# EAGLE schematic LED MATRIX PTH (EAGLE 8.3.2)
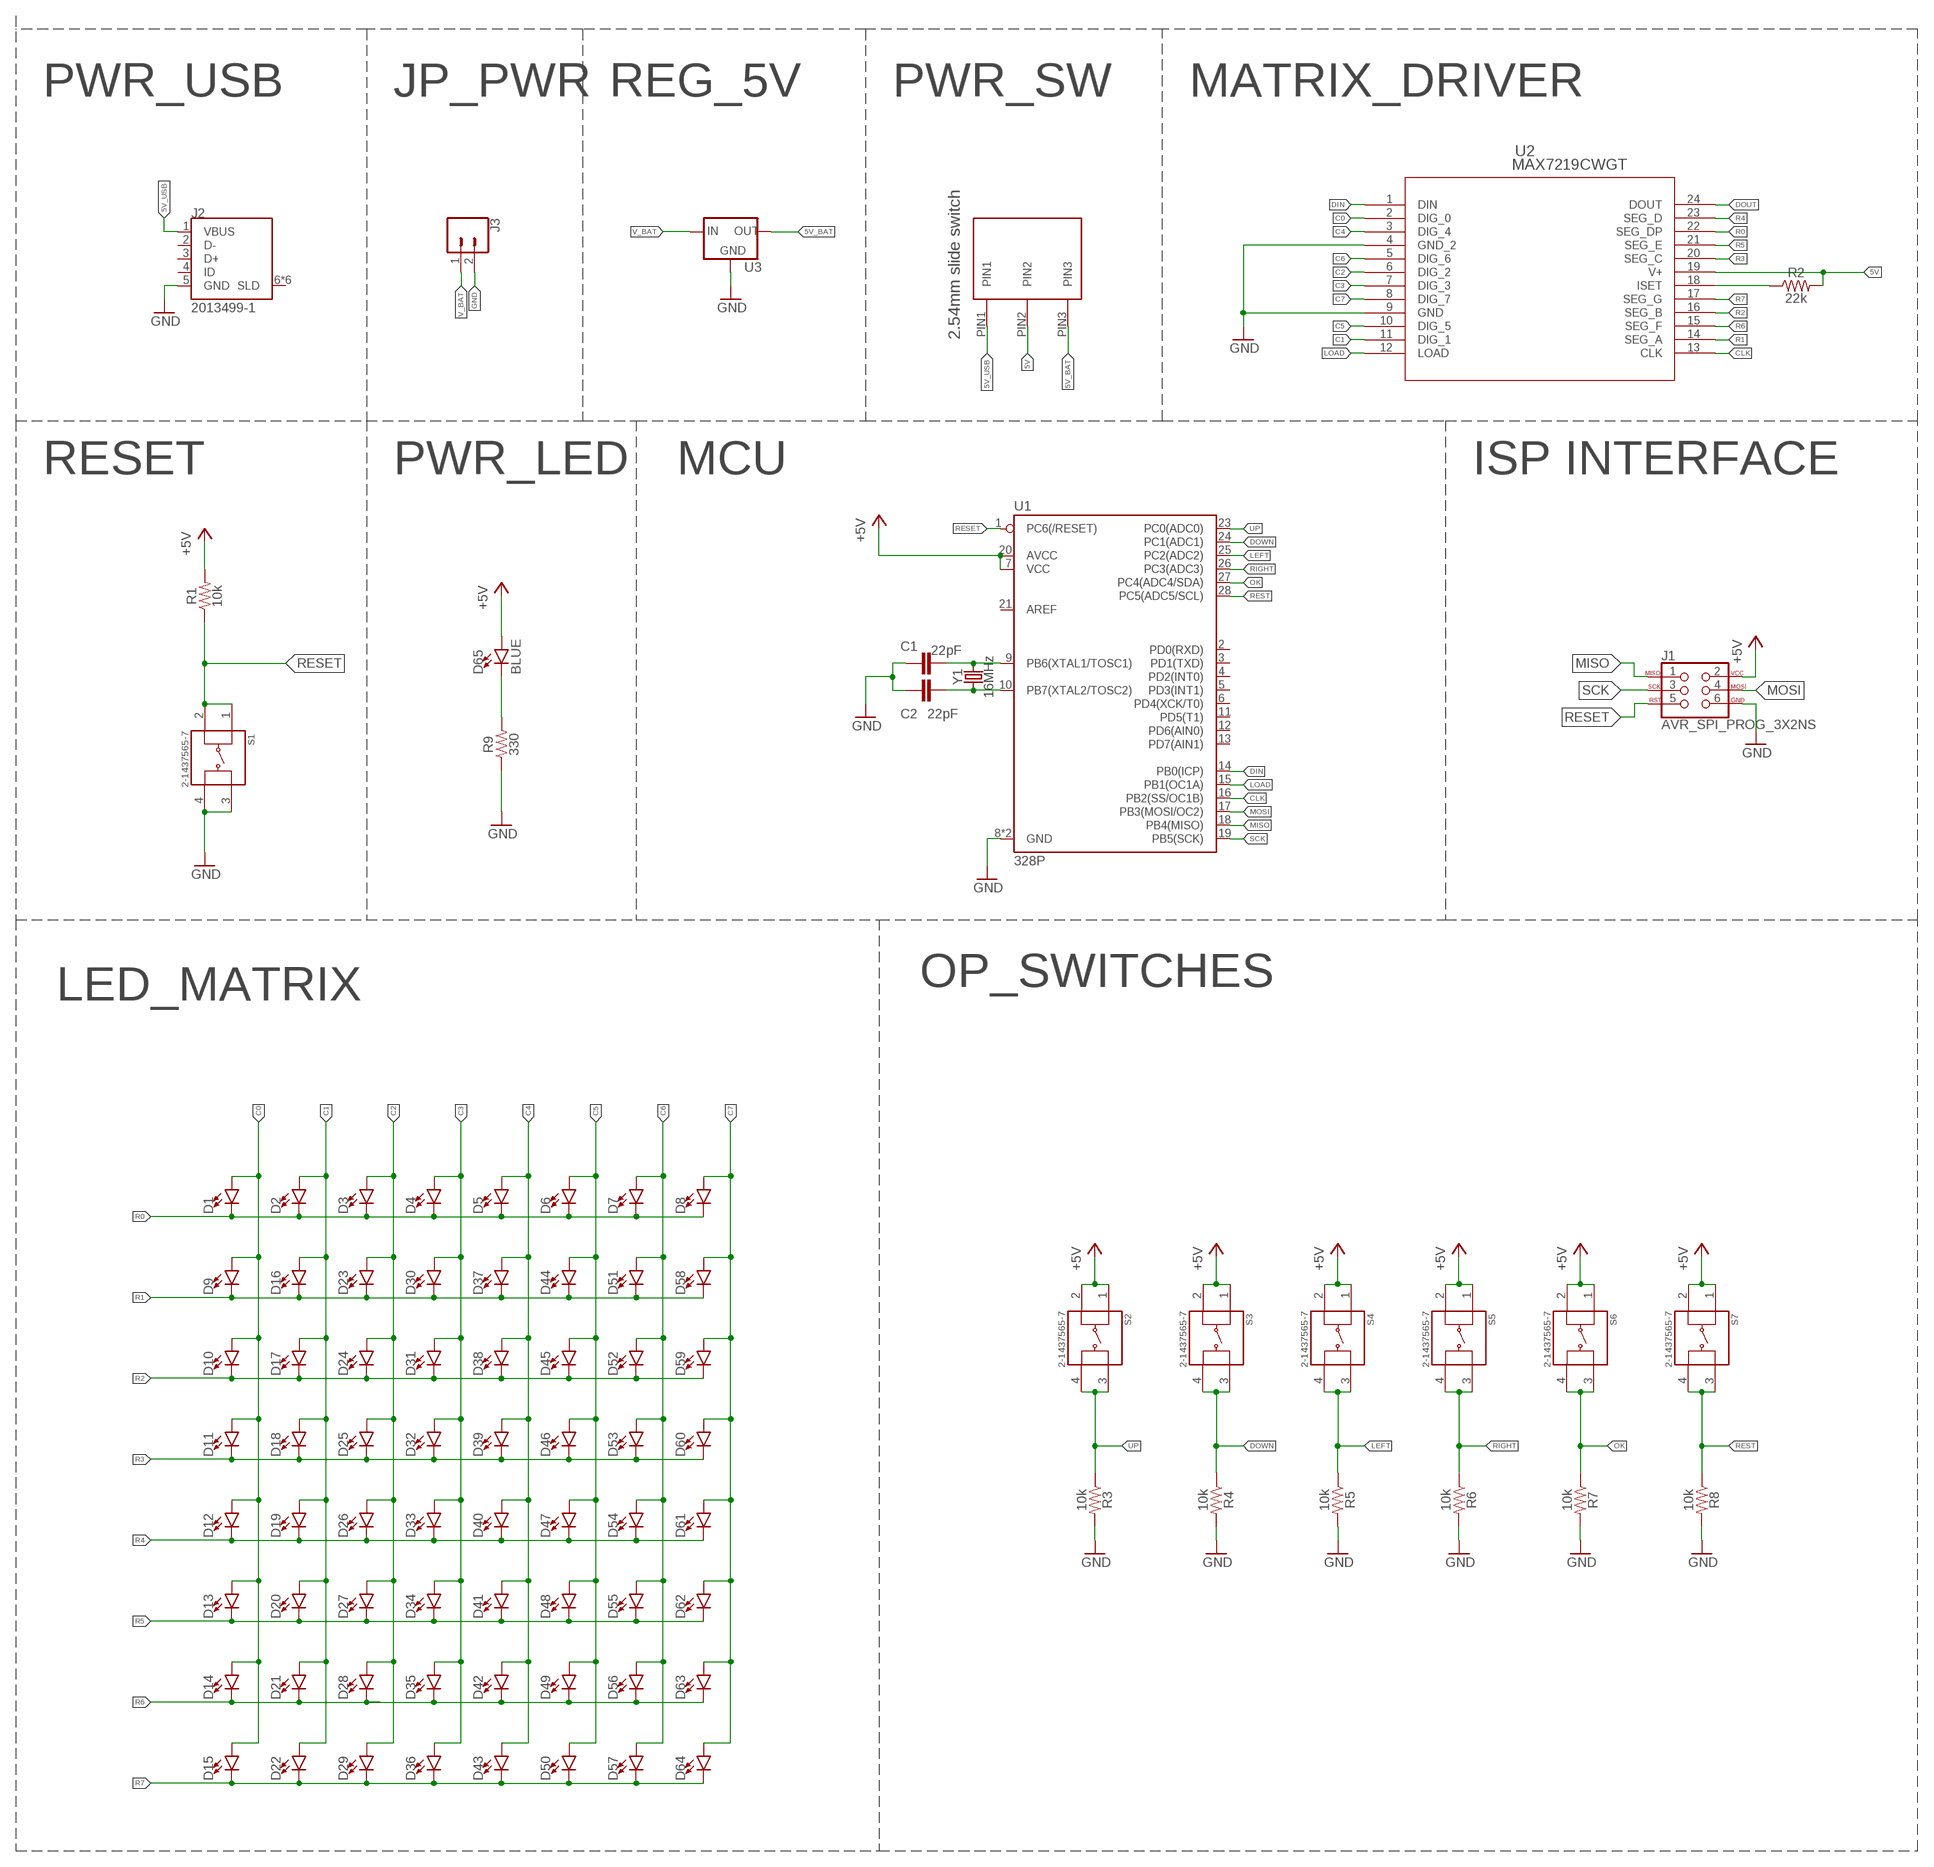
[diagram p0: schematic, sheet 1]

## Parts
C1  22pF  22PF-0603-50V-5%  [0603]
C2  22pF  22PF-0603-50V-5%  [0603]
D1  LED5MM  [LED_5MM]
D2  LED5MM  [LED_5MM]
D3  LED5MM  [LED_5MM]
D4  LED5MM  [LED_5MM]
D5  LED5MM  [LED_5MM]
D6  LED5MM  [LED_5MM]
D7  LED5MM  [LED_5MM]
D8  LED5MM  [LED_5MM]
D9  LED5MM  [LED_5MM]
D10  LED5MM  [LED_5MM]
D11  LED5MM  [LED_5MM]
D12  LED5MM  [LED_5MM]
D13  LED5MM  [LED_5MM]
D14  LED5MM  [LED_5MM]
D15  LED5MM  [LED_5MM]
D16  LED5MM  [LED_5MM]
D17  LED5MM  [LED_5MM]
D18  LED5MM  [LED_5MM]
D19  LED5MM  [LED_5MM]
D20  LED5MM  [LED_5MM]
D21  LED5MM  [LED_5MM]
D22  LED5MM  [LED_5MM]
D23  LED5MM  [LED_5MM]
D24  LED5MM  [LED_5MM]
D25  LED5MM  [LED_5MM]
D26  LED5MM  [LED_5MM]
D27  LED5MM  [LED_5MM]
D28  LED5MM  [LED_5MM]
D29  LED5MM  [LED_5MM]
D30  LED5MM  [LED_5MM]
D31  LED5MM  [LED_5MM]
D32  LED5MM  [LED_5MM]
D33  LED5MM  [LED_5MM]
D34  LED5MM  [LED_5MM]
D35  LED5MM  [LED_5MM]
D36  LED5MM  [LED_5MM]
D37  LED5MM  [LED_5MM]
D38  LED5MM  [LED_5MM]
D39  LED5MM  [LED_5MM]
D40  LED5MM  [LED_5MM]
D41  LED5MM  [LED_5MM]
D42  LED5MM  [LED_5MM]
D43  LED5MM  [LED_5MM]
D44  LED5MM  [LED_5MM]
D45  LED5MM  [LED_5MM]
D46  LED5MM  [LED_5MM]
D47  LED5MM  [LED_5MM]
D48  LED5MM  [LED_5MM]
D49  LED5MM  [LED_5MM]
D50  LED5MM  [LED_5MM]
D51  LED5MM  [LED_5MM]
D52  LED5MM  [LED_5MM]
D53  LED5MM  [LED_5MM]
D54  LED5MM  [LED_5MM]
D55  LED5MM  [LED_5MM]
D56  LED5MM  [LED_5MM]
D57  LED5MM  [LED_5MM]
D58  LED5MM  [LED_5MM]
D59  LED5MM  [LED_5MM]
D60  LED5MM  [LED_5MM]
D61  LED5MM  [LED_5MM]
D62  LED5MM  [LED_5MM]
D63  LED5MM  [LED_5MM]
D64  LED5MM  [LED_5MM]
D65  BLUE  LED-BLUE0603  [LED-0603]
J1  AVR_SPI_PROG_3X2NS  [2X3-NS]
J2  2013499-1  [TE_2013499-1]
J3  CONN_02  [1X02]
R1  10k  10KOHM-0603-1/10W-1%  [0603]
R2  22k  22KOHM-0603-1/10W-1%  [0603]
R3  10k  10KOHM-0603-1/10W-1%  [0603]
R4  10k  10KOHM-0603-1/10W-1%  [0603]
R5  10k  10KOHM-0603-1/10W-1%  [0603]
R6  10k  10KOHM-0603-1/10W-1%  [0603]
R7  10k  10KOHM-0603-1/10W-1%  [0603]
R8  10k  10KOHM-0603-1/10W-1%  [0603]
R9  330  330OHM-0603-1/10W-1%  [0603]
S1  2-1437565-7  [SW_2-1437565-7]
S2  2-1437565-7  [SW_2-1437565-7]
S3  2-1437565-7  [SW_2-1437565-7]
S4  2-1437565-7  [SW_2-1437565-7]
S5  2-1437565-7  [SW_2-1437565-7]
S6  2-1437565-7  [SW_2-1437565-7]
S7  2-1437565-7  [SW_2-1437565-7]
U1  328P  ATMEGA328P_PDIP  [DIP28]
U2  MAX7219CWGT  [21-0042B_24]
U3  V_REG_78XXSIDE  [78XXL]
U$1  TS02_SWITCH  [TS02_SWITCH]
Y1  16MHz  CRYSTAL-16MHZPTH-HC49US  [HC49US]

## Nets
5V: R2.2 U2.19(V+) U$1.PIN2
5V_BAT: U3.OUT U$1.PIN3
5V_USB: J2.1(VBUS) U$1.PIN1
+5V: D65.A J1.2 R1.2 S2.1 S2.2 S3.1 S3.2 S4.1 S4.2 S5.1 S5.2 S6.1 S6.2 S7.1 S7.2 U1.7(VCC) U1.20(AVCC)
C0: D1.A D9.A D10.A D11.A D12.A D13.A D14.A D15.A U2.2(DIG_0)
C1: D2.A D16.A D17.A D18.A D19.A D20.A D21.A D22.A U2.11(DIG_1)
C2: D3.A D23.A D24.A D25.A D26.A D27.A D28.A D29.A U2.6(DIG_2)
C3: D4.A D30.A D31.A D32.A D33.A D34.A D35.A D36.A U2.7(DIG_3)
C4: D5.A D37.A D38.A D39.A D40.A D41.A D42.A D43.A U2.3(DIG_4)
C5: D6.A D44.A D45.A D46.A D47.A D48.A D49.A D50.A U2.10(DIG_5)
C6: D7.A D51.A D52.A D53.A D54.A D55.A D56.A D57.A U2.5(DIG_6)
C7: D8.A D58.A D59.A D60.A D61.A D62.A D63.A D64.A U2.8(DIG_7)
CLK: U1.16(PB2(SS/OC1B)) U2.13(CLK)
DIN: U1.14(PB0(ICP)) U2.1(DIN)
DOUT: U2.24(DOUT)
DOWN: R4.1 S3.3 S3.4 U1.24(PC1(ADC1))
GND: C1.1 C2.1 J1.6 J2.5(GND) J3.2 R3.2 R4.2 R5.2 R6.2 R7.2 R8.2 R9.1 S1.3 S1.4 U1.8(GND) U1.22(GND) U2.4(GND_2) U2.9(GND) U3.GND
LEFT: R5.1 S4.3 S4.4 U1.25(PC2(ADC2))
LOAD: U1.15(PB1(OC1A)) U2.12(LOAD)
MISO: J1.1 U1.18(PB4(MISO))
MOSI: J1.4 U1.17(PB3(MOSI/OC2))
N$1: C2.2 U1.10(PB7(XTAL2/TOSC2)) Y1.1
N$2: C1.2 U1.9(PB6(XTAL1/TOSC1)) Y1.2
N$3: R2.1 U2.18(ISET)
N$4: D65.C R9.2
OK: R7.1 S6.3 S6.4 U1.27(PC4(ADC4/SDA))
R0: D1.K(C) D2.K(C) D3.K(C) D4.K(C) D5.K(C) D6.K(C) D7.K(C) D8.K(C) U2.22(SEG_DP)
R1: D9.K(C) D16.K(C) D23.K(C) D30.K(C) D37.K(C) D44.K(C) D51.K(C) D58.K(C) U2.14(SEG_A)
R2: D10.K(C) D17.K(C) D24.K(C) D31.K(C) D38.K(C) D45.K(C) D52.K(C) D59.K(C) U2.16(SEG_B)
R3: D11.K(C) D18.K(C) D25.K(C) D32.K(C) D39.K(C) D46.K(C) D53.K(C) D60.K(C) U2.20(SEG_C)
R4: D12.K(C) D19.K(C) D26.K(C) D33.K(C) D40.K(C) D47.K(C) D54.K(C) D61.K(C) U2.23(SEG_D)
R5: D13.K(C) D20.K(C) D27.K(C) D34.K(C) D41.K(C) D48.K(C) D55.K(C) D62.K(C) U2.21(SEG_E)
R6: D14.K(C) D21.K(C) D28.K(C) D35.K(C) D42.K(C) D49.K(C) D56.K(C) D63.K(C) U2.15(SEG_F)
R7: D15.K(C) D22.K(C) D29.K(C) D36.K(C) D43.K(C) D50.K(C) D57.K(C) D64.K(C) U2.17(SEG_G)
RESET: J1.5 R1.1 S1.1 S1.2 U1.1(PC6(/RESET))
REST: R8.1 S7.3 S7.4 U1.28(PC5(ADC5/SCL))
RIGHT: R6.1 S5.3 S5.4 U1.26(PC3(ADC3))
SCK: J1.3 U1.19(PB5(SCK))
UP: R3.1 S2.3 S2.4 U1.23(PC0(ADC0))
V_BAT: J3.1 U3.IN
Unconnected: J2.2(D-) J2.3(D+) J2.4(ID) J2.6(SLD) J2.7(SLD) J2.8(SLD) J2.9(SLD) J2.10(SLD) J2.11(SLD) U1.2(PD0(RXD)) U1.3(PD1(TXD)) U1.4(PD2(INT0)) U1.5(PD3(INT1)) U1.6(PD4(XCK/T0)) U1.11(PD5(T1)) U1.12(PD6(AIN0)) U1.13(PD7(AIN1)) U1.21(AREF)

## Notes on the sheet
- PWR_USB | JP_PWR | REG_5V | PWR_SW | MATRIX_DRIVER
- RESET | PWR_LED | MCU | ISP INTERFACE
- LED_MATRIX | OP_SWITCHES

## Library data of the parts
C1 C2 = SparkFun-Capacitors:22PF: 22pF ceramic capacitors A capacitor is a passive two-terminal electrical component used to store electrical energy temporarily in an electric field.; PROD_ID: CAP-07876
D1-D64 = SparkFun-LED:LED: LED (Generic) Standard schematic elements and footprints for 5mm, 3mm, 1206, and 0603 sized LEDs. Generic LEDs with no color specified.
D65 = SparkFun-LED:LED-BLUE: Blue SMD LED Used in manufacturing of various products at SparkFun Packages: 0603 - SMD 0603 package [Product Link] <http://www.digikey.com/product-detail/en/SMLE12BC7TT86/511-1589-2-ND/1641808> 1206 - SMD1206 package [Product Link] <http://www.digikey.com/product-detail/en/lite-on-inc/LTST-C150TBKT/160-1643-1-ND/573584> SparkFun Products: ESP8266 Thing-Dev Board <https://www.sparkfun.com/products/13711> RedBoard <https://www.sparkfun.com/products/12757>; PROD_ID: DIO-08575
J1 = SparkFun-Connectors:AVR_SPI_PROG_3X2: AVR ISP 6 Pin This is the reduced ISP connector for AVR programming. Common on Arduino. This footprint will take up less PCB space and can be used with a 10-pin to 6-pin adapter such as SKU: BOB-08508 **Special note about "TEST_POINT" package. The stop mask is on the top side, so if you want your programming test points to be on the bottom of your board, make sure to place this package on the bottom side of the board. This also ensure that the orientation to program from the bottom side will be correct. SparkFun Products: SparkFun ISP Pogo Adapter <https://www.sparkfun.com/products/11591> - NS Tiny AVR Programmer <https://www.sparkfun.com/products/11801> -PTH
J2 = 2013499-1:2013499-1: CONN PCB USB 5POS; AVAILABILITY: Unavailable; CENTERLINE_PITCH: .65 mm[.025 in]; COMMENT: 2013499-1; DESCRIPTION: Micro USB REC type B DIP assy_Au_; MF: TE Connectivity; MP: 2013499-1; NUMBER_OF_POSITIONS: 5; PACKAGE: None; PRICE: None; PRODUCT_TYPE: Connector; TE_PURCHASE_URL: https://www.te.com/usa-en/product-2013499-1.html?te_bu=Cor&te_type=disp&te_campaign=seda_glo_cor-seda-global-disp-prtnr-fy19-seda-model-bom-cta_sma-317_1&elqCampaignId=32493
J3 = SparkFun-Connectors:CONN_02: Multi connection point. Often used as Generic Header-pin footprint for 0.1 inch spaced/style header connections On any of the 0.1 inch spaced packages, you can populate with these: Break Away Headers - Straight <https://www.sparkfun.com/products/116> (PRT-00116) Break Away Male Headers - Right Angle <https://www.sparkfun.com/products/553> (PRT-00553) Female Headers <https://www.sparkfun.com/products/115> (PRT-00115) Break Away Headers - Machine Pin <https://www.sparkfun.com/products/117> (PRT-00117) Break Away Female Headers - Swiss Machine Pin <https://www.sparkfun.com/products/743> (PRT-00743) For SCREWTERMINALS and SPRING TERMINALS visit here: Screw Terimnals on SparkFun.com <https://www.sparkfun.com/search/results?term=Screw+Terminals> (5mm/3.5mm/2.54mm spacing) This device is also useful as a general connection point to wire up your design to another part of your project. Our various solder wires solder well into these plated through hole pads. Hook-Up Wire - Assortment (Stranded, 22 AWG) <https://www.sparkfun.com/products/11375> (PRT-11375) Hook-Up Wire - Assortment (Solid Core, 22 AWG) <https://www.sparkfun.com/products/11367> (PRT-11367) View the entire wire category on our website here <https://www.sparkfun.com/categories/141> Special notes: Molex polarized connector foot print use with: PRT-08233 with associated crimp pins and housings. 2.54_SCREWTERM for use with PRT-10571. 3.5mm Screw Terminal footprints for PRT-08084 5mm Screw Terminal footprints for use with PRT-08432
R1 R3-R8 = SparkFun-Resistors:10KOHM: 10kΩ resistor A resistor is a passive two-terminal electrical component that implements electrical resistance as a circuit element. Resistors act to reduce current flow, and, at the same time, act to lower voltage levels within circuits. - Wikipedia; PROD_ID: RES-00824
R2 = SparkFun-Resistors:22KOHM: 22kΩ resistor A resistor is a passive two-terminal electrical component that implements electrical resistance as a circuit element. Resistors act to reduce current flow, and, at the same time, act to lower voltage levels within circuits. - Wikipedia; PROD_ID: RES-07853
R9 = SparkFun-Resistors:330OHM: 330Ω resistor A resistor is a passive two-terminal electrical component that implements electrical resistance as a circuit element. Resistors act to reduce current flow, and, at the same time, act to lower voltage levels within circuits. - Wikipedia; PROD_ID: RES-00818
S1-S7 = 2-1437565-7:2-1437565-7: FSM2JSMA=SMT,TACTILE,PB SWITCH; MANUFACTURER: TE Connectivity; PARTREV: V; STANDARD: Manufacturer recommendations
U1 = SparkFun-IC-Microcontroller:ATMEGA328P_PDIP: Atmel 328P Through hole ATMEGA328P uC used in the Arduino 32kb flash, 1k EEPROM, 2k SRAM Datasheet <http://www.sparkfun.com/datasheets/Components/SMD/ATMega328.pdf> SparkFun Products Storefront component: AVR 28 Pin 20MHz 32K 6A/D - ATMega328P <https://www.sparkfun.com/products/9061> (COM-09061) SparkFun Simon Says - Through-Hole Soldering Kit <https://www.sparkfun.com/products/10547> (KIT-10547) SparkFun Learn to Solder - Simon Says <https://www.sparkfun.com/products/13708> (KIT-13708) SparkFun BigTime Watch Kit <https://www.sparkfun.com/products/11734> (KIT-11734) SparkFun ClockIt <https://www.sparkfun.com/products/10930> (KIT-10930) SparkFun Serial Enabled LCD Kit <https://www.sparkfun.com/products/10097> (LCD-10097) SparkFun Simon Tilts - Through Hole Soldering Kit <https://www.sparkfun.com/products/12634> (KIT-12634) SparkFun Frequency Counter Kit <https://www.sparkfun.com/products/10140> (KIT-10140) FabFM Radio Kit <https://www.sparkfun.com/products/11043> (KIT-11043) SparkFun Binary Blaster Kit <https://www.sparkfun.com/products/12037> (KIT-12037) SparkFun Metro-Gnome <https://www.sparkfun.com/products/9236> (KIT-09236) ATmega328 with Arduino Optiboot (Uno) <https://www.sparkfun.com/products/10524> (DEV-10524); PROD_ID: IC-09136
U2 = MAX7219CWGT:MAX7219CWGT; AVAILABILITY: Unavailable; DESCRIPTION: Ic Drvr Dsply Led 8dig 24soic - Max7219cwg+t; MF: Maxim Integrated; MP: MAX7219CWG+T; PACKAGE: SOIC-24 Maxim Integrated; PRICE: None
U3 = SparkFun-IC-Power:V_REG_78XX: Voltage Regulator Standard 78xx regulator. IGO (Input Ground Output). Spark Fun Electronics SKU : COM-00107
U$1 = 2.54mm slide switch:TS02_SWITCH
Y1 = SparkFun-Clocks:CRYSTAL-16MHZ: 16MHz Crystal Digikey Example <http://www.digikey.com/product-search/en?keywords=535-9122-1-ND> Frequency: 16MHz Frequency Stability: ±50ppm Frequency Tolerance: ±20ppm Load Capacitance: 18pF SparkFun Products: Pro Micro -5V/16MHz <https://www.sparkfun.com/products/12640> SparkFun Serial Enabled LCD Kit <https://www.sparkfun.com/products/10097>; PROD_ID: XTAL-08181; SF_ID: COM-00536